# Altium project LimeSDR-USB_1v4.PrjPcb (part 8 of 8)
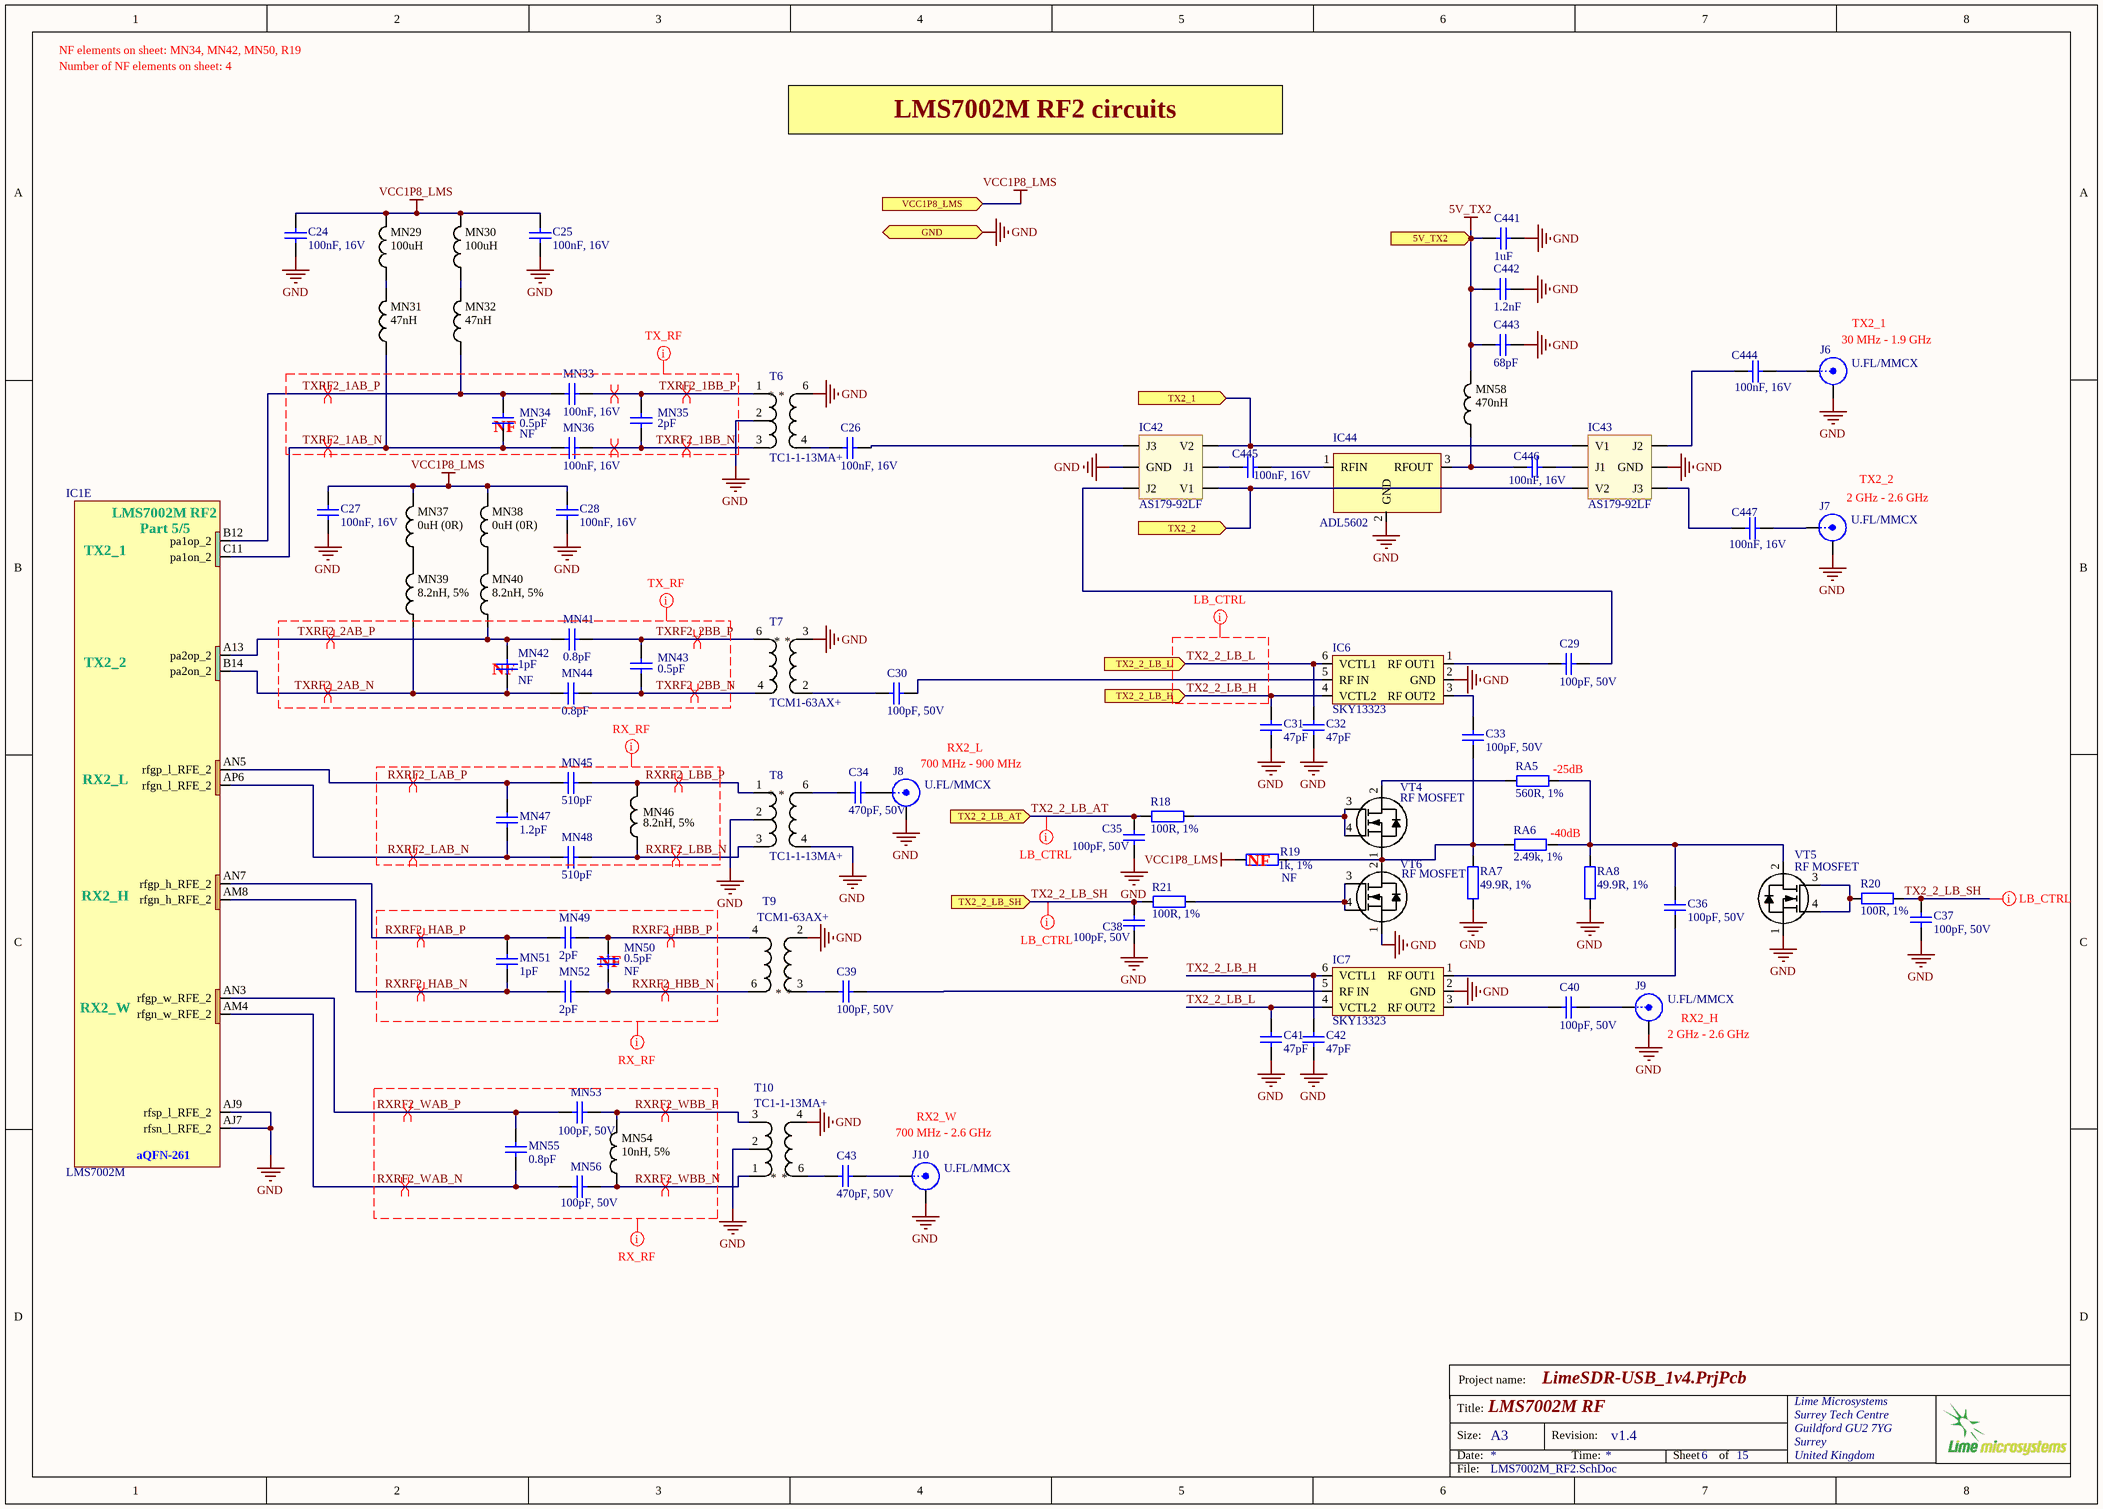
[diagram p114: LMS7002M_RF2.SchDoc]

## Nets that join several sheets
5V_TX1: LMS7002M (C448.2 IC47.9 IC47.10), LMS7002M_RF1 (C434.2 C435.2 C436.2 MN57.2)
5V_TX2: LMS7002M (C450.2 IC48.9 IC48.10), LMS7002M_RF2 (C441.2 C442.2 C443.2 MN58.2)
GND: BoardDiagramEntryConn (C380.1 C381.2 R107.1), 15_BoardPowerSupply (91 pins), 16_BoardPowerSupplyBattery (30 pins), 12_USB3_0_device (79 pins), 13_USB3_0_peripheral (25 pins), FPGA (LED7.3 LEDS1.K2 R50.1), 09_FPGA_banks_5_6_7_8 (22 pins), 08_FPGA_banks_1_2_3_4 (17 pins), LMS7002M (11 pins), LMS7002M_Misc (13 pins), LMS7002M_RF1 (38 pins), LMS7002M_RF2 (38 pins)
VCC3P3_CLK: 15_BoardPowerSupply (R208.1), 14_Clocks (16 pins)
VCC5P0_USB: 16_BoardPowerSupplyBattery (5 pins), 12_USB3_0_device (C272.1 FR38.1 J15.1)
VCC6P0: 15_BoardPowerSupply (8 pins), LMS7002M (9 pins)
VCC_LMS1: 15_BoardPowerSupply (R178.1), LMS7002M_RF1 (9 pins), LMS7002M_RF2 (9 pins)
VCC_P0: 15_BoardPowerSupply (11 pins), 12_USB3_0_device (FR45.2 FR46.2 FR47.2 FR48.1), 10_FPGA_misc (R220.2)
VCC_P2: BoardDiagramEntryConn (R106.2), 15_BoardPowerSupply (R173.1 R211.1), 12_USB3_0_device (FR43.2), 10_FPGA_misc (FR37.1)
VCC_P3: BoardDiagramEntryConn (R105.2 R113.1 R134.1), 15_BoardPowerSupply (28 pins), 12_USB3_0_device (5 pins), 13_USB3_0_peripheral (23 pins), FPGA (R170.1), 10_FPGA_misc (R219.2), 11_DDR2 (C394.2 IC29.10 R177.1 R186.1)
VCC_SYS: 15_BoardPowerSupply (15 pins), 16_BoardPowerSupplyBattery (9 pins), 12_USB3_0_device (FR40.1)
VDIO_LMS: BoardDiagramEntryConn (C380.2 C381.1 FR57.2), LMS7002M_Misc (14 pins)
VDIO_LMS_FPGA: BoardDiagramEntryConn (FR57.1 R105.1 R106.1 R112.1), 14_Clocks (FR50.1), FPGA (R49.2), 10_FPGA_misc (R221.2)
VREF_DDR2: 08_FPGA_banks_1_2_3_4 (24 pins), 11_DDR2 (6 pins)
BQ_INT: 16_BoardPowerSupplyBattery (IC37.7 R217.1), 09_FPGA_banks_5_6_7_8 (IC8.F21)
BQ_nCE: 16_BoardPowerSupplyBattery (IC37.9), 12_USB3_0_device (R63#1.1), 09_FPGA_banks_5_6_7_8 (IC8.H19)
BQ_OTG: 16_BoardPowerSupplyBattery (IC37.8), 09_FPGA_banks_5_6_7_8 (IC8.H20)
DDR2_1_A0: 08_FPGA_banks_1_2_3_4 (IC8.W1), 11_DDR2 (IC11.M8 R77.5)
DDR2_1_A1: 08_FPGA_banks_1_2_3_4 (IC8.AA3), 11_DDR2 (IC11.M3 R75.7)
DDR2_1_A2: 08_FPGA_banks_1_2_3_4 (IC8.Y3), 11_DDR2 (IC11.M7 R77.4)
DDR2_1_A3: 08_FPGA_banks_1_2_3_4 (IC8.V6), 11_DDR2 (IC11.N2 R75.4)
DDR2_1_A4: 08_FPGA_banks_1_2_3_4 (IC8.AA1), 11_DDR2 (IC11.N8 R77.3)
DDR2_1_A5: 08_FPGA_banks_1_2_3_4 (IC8.AB3), 11_DDR2 (IC11.N3 R75.5)
DDR2_1_A6: 08_FPGA_banks_1_2_3_4 (IC8.Y2), 11_DDR2 (IC11.N7 R77.2)
DDR2_1_A7: 08_FPGA_banks_1_2_3_4 (IC8.AB5), 11_DDR2 (IC11.P2 R75.1)
DDR2_1_A8: 08_FPGA_banks_1_2_3_4 (IC8.Y1), 11_DDR2 (IC11.P8 R77.1)
DDR2_1_A9: 08_FPGA_banks_1_2_3_4 (IC8.V7), 11_DDR2 (IC11.P3 R75.3)
DDR2_1_A10: 08_FPGA_banks_1_2_3_4 (IC8.Y6), 11_DDR2 (IC11.M2 R75.6)
DDR2_1_A11: 08_FPGA_banks_1_2_3_4 (IC8.W2), 11_DDR2 (IC11.P7 R75.8)
DDR2_1_A12: 08_FPGA_banks_1_2_3_4 (IC8.T8), 11_DDR2 (IC11.R2 R75.2)
DDR2_1_BA0: 08_FPGA_banks_1_2_3_4 (IC8.V4), 11_DDR2 (IC11.L2 R78.2)
DDR2_1_BA1: 08_FPGA_banks_1_2_3_4 (IC8.V3), 11_DDR2 (IC11.L3 R78.3)
DDR2_1_BA2: 08_FPGA_banks_1_2_3_4 (IC8.V1), 11_DDR2 (IC11.L1 R78.4)
DDR2_1_CLK_N: 08_FPGA_banks_1_2_3_4 (IC8.U8), 11_DDR2 (IC11.K8 R76.2)
DDR2_1_CLK_P: 08_FPGA_banks_1_2_3_4 (IC8.U7), 11_DDR2 (IC11.J8 R76.1)
DDR2_1_CTL0: 08_FPGA_banks_1_2_3_4 (IC8.R7), 11_DDR2 (IC11.K2)
DDR2_1_CTL1: 08_FPGA_banks_1_2_3_4 (IC8.P6), 11_DDR2 (IC11.K9)
DDR2_1_CTL2: 08_FPGA_banks_1_2_3_4 (IC8.T5), 11_DDR2 (IC11.K7)
DDR2_1_CTL3: 08_FPGA_banks_1_2_3_4 (IC8.T4), 11_DDR2 (IC11.L7)
DDR2_1_CTL4: 08_FPGA_banks_1_2_3_4 (IC8.R6), 11_DDR2 (IC11.L8)
DDR2_1_CTL5: 08_FPGA_banks_1_2_3_4 (IC8.T7), 11_DDR2 (IC11.K3)
DDR2_1_DM0: 08_FPGA_banks_1_2_3_4 (IC8.AA7), 11_DDR2 (IC11.F3)
DDR2_1_DM1: 08_FPGA_banks_1_2_3_4 (IC8.V5), 11_DDR2 (IC11.B3)
DDR2_1_DQ0: 08_FPGA_banks_1_2_3_4 (IC8.U10), 11_DDR2 (IC11.G8)
DDR2_1_DQ1: 08_FPGA_banks_1_2_3_4 (IC8.AB8), 11_DDR2 (IC11.G2)
DDR2_1_DQ2: 08_FPGA_banks_1_2_3_4 (IC8.AB7), 11_DDR2 (IC11.H7)
DDR2_1_DQ3: 08_FPGA_banks_1_2_3_4 (IC8.AA9), 11_DDR2 (IC11.H3)
DDR2_1_DQ4: 08_FPGA_banks_1_2_3_4 (IC8.V11), 11_DDR2 (IC11.H1)
DDR2_1_DQ5: 08_FPGA_banks_1_2_3_4 (IC8.W10), 11_DDR2 (IC11.H9)
DDR2_1_DQ6: 08_FPGA_banks_1_2_3_4 (IC8.AA8), 11_DDR2 (IC11.F1)
DDR2_1_DQ7: 08_FPGA_banks_1_2_3_4 (IC8.Y10), 11_DDR2 (IC11.F9)
DDR2_1_DQ8: 08_FPGA_banks_1_2_3_4 (IC8.W6), 11_DDR2 (IC11.C8)
DDR2_1_DQ9: 08_FPGA_banks_1_2_3_4 (IC8.AA5), 11_DDR2 (IC11.C2)
DDR2_1_DQ10: 08_FPGA_banks_1_2_3_4 (IC8.W7), 11_DDR2 (IC11.D7)
DDR2_1_DQ11: 08_FPGA_banks_1_2_3_4 (IC8.V8), 11_DDR2 (IC11.D3)
DDR2_1_DQ12: 08_FPGA_banks_1_2_3_4 (IC8.W8), 11_DDR2 (IC11.D1)
DDR2_1_DQ13: 08_FPGA_banks_1_2_3_4 (IC8.Y7), 11_DDR2 (IC11.D9)
DDR2_1_DQ14: 08_FPGA_banks_1_2_3_4 (IC8.U9), 11_DDR2 (IC11.B1)
DDR2_1_DQ15: 08_FPGA_banks_1_2_3_4 (IC8.AA4), 11_DDR2 (IC11.B9)
DDR2_1_DQS0: 08_FPGA_banks_1_2_3_4 (IC8.AB9), 11_DDR2 (IC11.F7)
DDR2_1_DQS1: 08_FPGA_banks_1_2_3_4 (IC8.V10), 11_DDR2 (IC11.B7)
DDR2_2_A0: 08_FPGA_banks_1_2_3_4 (IC8.U15), 11_DDR2 (IC12.M8 R81.3)
DDR2_2_A1: 08_FPGA_banks_1_2_3_4 (IC8.AA17), 11_DDR2 (IC12.M3 R83.7)
DDR2_2_A2: 08_FPGA_banks_1_2_3_4 (IC8.T14), 11_DDR2 (IC12.M7 R81.1)
DDR2_2_A3: 08_FPGA_banks_1_2_3_4 (IC8.Y17), 11_DDR2 (IC12.N2 R83.2)
DDR2_2_A4: 08_FPGA_banks_1_2_3_4 (IC8.T16), 11_DDR2 (IC12.N8 R81.5)
DDR2_2_A5: 08_FPGA_banks_1_2_3_4 (IC8.P7), 11_DDR2 (IC12.N3 R83.6)
DDR2_2_A6: 08_FPGA_banks_1_2_3_4 (IC8.U17), 11_DDR2 (IC12.N7 R81.2)
DDR2_2_A7: 08_FPGA_banks_1_2_3_4 (IC8.N8), 11_DDR2 (IC12.P2 R83.3)
DDR2_2_A8: 08_FPGA_banks_1_2_3_4 (IC8.R16), 11_DDR2 (IC12.P8 R81.6)
DDR2_2_A9: 08_FPGA_banks_1_2_3_4 (IC8.AA20), 11_DDR2 (IC12.P3 R83.5)
DDR2_2_A10: 08_FPGA_banks_1_2_3_4 (IC8.AB17), 11_DDR2 (IC12.M2 R83.1)
DDR2_2_A11: 08_FPGA_banks_1_2_3_4 (IC8.U16), 11_DDR2 (IC12.P7 R81.4)
DDR2_2_A12: 08_FPGA_banks_1_2_3_4 (IC8.U14), 11_DDR2 (IC12.R2 R83.4)
DDR2_2_BA0: 08_FPGA_banks_1_2_3_4 (IC8.U13), 11_DDR2 (IC12.L2 R84.3)
DDR2_2_BA1: 08_FPGA_banks_1_2_3_4 (IC8.T13), 11_DDR2 (IC12.L3 R84.2)
DDR2_2_BA2: 08_FPGA_banks_1_2_3_4 (IC8.V2), 11_DDR2 (IC12.L1 R84.4)
DDR2_2_CLK_N: 08_FPGA_banks_1_2_3_4 (IC8.R15), 11_DDR2 (IC12.K8 R82.2)
DDR2_2_CLK_P: 08_FPGA_banks_1_2_3_4 (IC8.R14), 11_DDR2 (IC12.J8 R82.1)
DDR2_2_CTL0: 08_FPGA_banks_1_2_3_4 (IC8.AB10), 11_DDR2 (IC12.K2)
DDR2_2_CTL1: 08_FPGA_banks_1_2_3_4 (IC8.T12), 11_DDR2 (IC12.K9)
DDR2_2_CTL2: 08_FPGA_banks_1_2_3_4 (IC8.T11), 11_DDR2 (IC12.K7)
DDR2_2_CTL3: 08_FPGA_banks_1_2_3_4 (IC8.T10), 11_DDR2 (IC12.L7)
DDR2_2_CTL4: 08_FPGA_banks_1_2_3_4 (IC8.Y8), 11_DDR2 (IC12.L8)
DDR2_2_CTL5: 08_FPGA_banks_1_2_3_4 (IC8.T9), 11_DDR2 (IC12.K3)
DDR2_2_DM0: 08_FPGA_banks_1_2_3_4 (IC8.AA16), 11_DDR2 (IC12.F3)
DDR2_2_DM1: 08_FPGA_banks_1_2_3_4 (IC8.AA10), 11_DDR2 (IC12.B3)
DDR2_2_DQ0: 08_FPGA_banks_1_2_3_4 (IC8.W15), 11_DDR2 (IC12.G8)
DDR2_2_DQ1: 08_FPGA_banks_1_2_3_4 (IC8.V14), 11_DDR2 (IC12.G2)
DDR2_2_DQ2: 08_FPGA_banks_1_2_3_4 (IC8.AB20), 11_DDR2 (IC12.H7)
DDR2_2_DQ3: 08_FPGA_banks_1_2_3_4 (IC8.AB18), 11_DDR2 (IC12.H3)
DDR2_2_DQ4: 08_FPGA_banks_1_2_3_4 (IC8.T15), 11_DDR2 (IC12.H1)
DDR2_2_DQ5: 08_FPGA_banks_1_2_3_4 (IC8.W17), 11_DDR2 (IC12.H9)
DDR2_2_DQ6: 08_FPGA_banks_1_2_3_4 (IC8.AB16), 11_DDR2 (IC12.F1)
DDR2_2_DQ7: 08_FPGA_banks_1_2_3_4 (IC8.V15), 11_DDR2 (IC12.F9)
DDR2_2_DQ8: 08_FPGA_banks_1_2_3_4 (IC8.W13), 11_DDR2 (IC12.C8)
DDR2_2_DQ9: 08_FPGA_banks_1_2_3_4 (IC8.AB13), 11_DDR2 (IC12.C2)
DDR2_2_DQ10: 08_FPGA_banks_1_2_3_4 (IC8.AA15), 11_DDR2 (IC12.D7)
DDR2_2_DQ11: 08_FPGA_banks_1_2_3_4 (IC8.AB14), 11_DDR2 (IC12.D3)
DDR2_2_DQ12: 08_FPGA_banks_1_2_3_4 (IC8.AA14), 11_DDR2 (IC12.D1)
DDR2_2_DQ13: 08_FPGA_banks_1_2_3_4 (IC8.AB15), 11_DDR2 (IC12.D9)
DDR2_2_DQ14: 08_FPGA_banks_1_2_3_4 (IC8.AA13), 11_DDR2 (IC12.B1)
DDR2_2_DQ15: 08_FPGA_banks_1_2_3_4 (IC8.U12), 11_DDR2 (IC12.B9)
DDR2_2_DQS0: 08_FPGA_banks_1_2_3_4 (IC8.V13), 11_DDR2 (IC12.F7)
DDR2_2_DQS1: 08_FPGA_banks_1_2_3_4 (IC8.Y13), 11_DDR2 (IC12.B7)
EXP_CONF_DONE: BoardDiagramEntryConn (R176.1), 13_USB3_0_peripheral (IC18.5)
EXP_NCONFIG: BoardDiagramEntryConn (R135.1), 13_USB3_0_peripheral (IC18.9)
EXP_NSTATUS: BoardDiagramEntryConn (R172.1), 13_USB3_0_peripheral (IC18.4)
FAN_CTRL: 08_FPGA_banks_1_2_3_4 (IC8.E4), 10_FPGA_misc (R65.2 R67.1 VT7.G)
FPF_EN: 16_BoardPowerSupplyBattery (IC16.C2 R187#1.2), 09_FPGA_banks_5_6_7_8 (IC8.B21)
FPF_VINSEL: 16_BoardPowerSupplyBattery (IC16.D4), FPGA (R48.1)
FPGA_CONF_DONE: BoardDiagramEntryConn (R112.2 R176.2), 10_FPGA_misc (IC25#1.M18)
FPGA_GPIO0: 08_FPGA_banks_1_2_3_4 (IC8.H8), 10_FPGA_misc (J12.1)
FPGA_GPIO1: 08_FPGA_banks_1_2_3_4 (IC8.H6), 10_FPGA_misc (J12.2)
FPGA_GPIO2: 08_FPGA_banks_1_2_3_4 (IC8.H2), 10_FPGA_misc (J12.3)
FPGA_GPIO3: 08_FPGA_banks_1_2_3_4 (IC8.H1), 10_FPGA_misc (J12.4)
FPGA_GPIO4: 08_FPGA_banks_1_2_3_4 (IC8.G4), 10_FPGA_misc (J12.5)
FPGA_GPIO5: 08_FPGA_banks_1_2_3_4 (IC8.G3), 10_FPGA_misc (J12.6)
FPGA_GPIO6: 08_FPGA_banks_1_2_3_4 (IC8.F2), 10_FPGA_misc (J12.7)
FPGA_GPIO7: 08_FPGA_banks_1_2_3_4 (IC8.F1), 10_FPGA_misc (J12.8)
FPGA_LED1_G: FPGA (R169.1), 08_FPGA_banks_1_2_3_4 (IC8.D2)
FPGA_LED1_R: FPGA (LED2.2 LED2.3 LEDS2.K1), 08_FPGA_banks_1_2_3_4 (IC8.E3)
FPGA_LED2_G: FPGA (R171.1), 08_FPGA_banks_1_2_3_4 (IC8.J4)
FPGA_LED2_R: FPGA (LED8.2 LED8.3 LEDS2.K2), 08_FPGA_banks_1_2_3_4 (IC8.E1)
FPGA_NCONFIG: BoardDiagramEntryConn (R134.2 R135.2), 10_FPGA_misc (IC25#1.K5)
FPGA_NSTATUS: BoardDiagramEntryConn (R113.2 R172.2), 10_FPGA_misc (IC25#1.K6)
FX3_DQ0: 12_USB3_0_device (R87.2), 09_FPGA_banks_5_6_7_8 (IC8.M19)
FX3_DQ1: 12_USB3_0_device (R87.4), 09_FPGA_banks_5_6_7_8 (IC8.AA21)
FX3_DQ2: 12_USB3_0_device (R87.6), 09_FPGA_banks_5_6_7_8 (IC8.Y22)
FX3_DQ3: 12_USB3_0_device (R87.8), 09_FPGA_banks_5_6_7_8 (IC8.Y21)
FX3_DQ4: 12_USB3_0_device (R89.2), 09_FPGA_banks_5_6_7_8 (IC8.W22)
FX3_DQ5: 12_USB3_0_device (R89.4), 09_FPGA_banks_5_6_7_8 (IC8.W21)
FX3_DQ6: 12_USB3_0_device (R89.6), 09_FPGA_banks_5_6_7_8 (IC8.W20)
FX3_DQ7: 12_USB3_0_device (R89.8), 09_FPGA_banks_5_6_7_8 (IC8.V22)
FX3_DQ8: 12_USB3_0_device (R91.2), 09_FPGA_banks_5_6_7_8 (IC8.V21)
FX3_DQ9: 12_USB3_0_device (R91.4), 09_FPGA_banks_5_6_7_8 (IC8.U22)
FX3_DQ10: 12_USB3_0_device (R91.6), 09_FPGA_banks_5_6_7_8 (IC8.U21)
FX3_DQ11: 12_USB3_0_device (R91.8), 09_FPGA_banks_5_6_7_8 (IC8.U20)
FX3_DQ12: 12_USB3_0_device (R96.2), 09_FPGA_banks_5_6_7_8 (IC8.U19)
FX3_DQ13: 12_USB3_0_device (R96.4), 09_FPGA_banks_5_6_7_8 (IC8.M22)
FX3_DQ14: 12_USB3_0_device (R96.6), 09_FPGA_banks_5_6_7_8 (IC8.M21)
FX3_DQ15: 12_USB3_0_device (R96.8), 09_FPGA_banks_5_6_7_8 (IC8.R22)
FX3_DQ16: 12_USB3_0_device (R88.1), 09_FPGA_banks_5_6_7_8 (IC8.R21)
FX3_DQ17: 12_USB3_0_device (R88.3), 09_FPGA_banks_5_6_7_8 (IC8.R20)
FX3_DQ18: 12_USB3_0_device (R88.5), 09_FPGA_banks_5_6_7_8 (IC8.R19)
FX3_DQ19: 12_USB3_0_device (R88.7), 09_FPGA_banks_5_6_7_8 (IC8.R18)
FX3_DQ20: 12_USB3_0_device (R90.1), 09_FPGA_banks_5_6_7_8 (IC8.P22)
FX3_DQ21: 12_USB3_0_device (R90.3), 09_FPGA_banks_5_6_7_8 (IC8.P21)
FX3_DQ22: 12_USB3_0_device (R90.5), 09_FPGA_banks_5_6_7_8 (IC8.M20)
FX3_DQ23: 12_USB3_0_device (R90.7), 09_FPGA_banks_5_6_7_8 (IC8.P16)
FX3_DQ24: 12_USB3_0_device (R94.1), 09_FPGA_banks_5_6_7_8 (IC8.P15)
FX3_DQ25: 12_USB3_0_device (R94.3), 09_FPGA_banks_5_6_7_8 (IC8.N22)
FX3_DQ26: 12_USB3_0_device (R94.5), 09_FPGA_banks_5_6_7_8 (IC8.N21)
FX3_DQ27: 12_USB3_0_device (R94.7), 09_FPGA_banks_5_6_7_8 (IC8.N20)
FX3_DQ28: 12_USB3_0_device (R97.1), 09_FPGA_banks_5_6_7_8 (IC8.N19)
FX3_DQ29: 12_USB3_0_device (R97.3), 09_FPGA_banks_5_6_7_8 (IC8.N18)
FX3_DQ30: 12_USB3_0_device (R97.5), 09_FPGA_banks_5_6_7_8 (IC8.N17)
FX3_DQ31: 12_USB3_0_device (R97.7), 09_FPGA_banks_5_6_7_8 (IC8.N16)
FX3_I2C_SCL: 16_BoardPowerSupplyBattery (IC37.5), 12_USB3_0_device (IC13.D9 R103.2), FPGA (R110.2), 10_FPGA_misc (IC40.8)
FX3_I2C_SDA: 16_BoardPowerSupplyBattery (IC37.6), 12_USB3_0_device (IC13.D10 R104.2), FPGA (R111.2), 10_FPGA_misc (IC40.7)
FX3_LED_G: FPGA (R168.1), 08_FPGA_banks_1_2_3_4 (IC8.G5)
FX3_LED_R: FPGA (LED1.2 LED1.3 LEDS1.K1), 08_FPGA_banks_1_2_3_4 (IC8.H5)
FX3_PCLK: 12_USB3_0_device (R98.1), 10_FPGA_misc (IC8.T21)
FX3_USB_D_N: 16_BoardPowerSupplyBattery (IC38.4), 12_USB3_0_device (IC13.A10)
FX3_USB_D_P: 16_BoardPowerSupplyBattery (IC38.2), 12_USB3_0_device (IC13.A9)
FX3_VBUS: 15_BoardPowerSupply (R185.1), 12_USB3_0_device (C273.2 FR38.2 IC13.E11)
LM75_OS: 13_USB3_0_peripheral (IC17.3 R133.1), 08_FPGA_banks_1_2_3_4 (IC8.J6), 10_FPGA_misc (R65.1)
LMK_CLK: 14_Clocks (IC20.15), 10_FPGA_misc (IC8.B12)
LMS_CORE_LDO_EN: 09_FPGA_banks_5_6_7_8 (IC8.B18), LMS7002M_Misc (IC1.U33 R5.1)
LMS_DIQ1_D0: 09_FPGA_banks_5_6_7_8 (IC8.B17), LMS7002M_Misc (IC1.AG31)
LMS_DIQ1_D1: 09_FPGA_banks_5_6_7_8 (IC8.B16), LMS7002M_Misc (IC1.AF30)
LMS_DIQ1_D2: 09_FPGA_banks_5_6_7_8 (IC8.B15), LMS7002M_Misc (IC1.AF34)
LMS_DIQ1_D3: 09_FPGA_banks_5_6_7_8 (IC8.B14), LMS7002M_Misc (IC1.AE31)
LMS_DIQ1_D4: 09_FPGA_banks_5_6_7_8 (IC8.B13), LMS7002M_Misc (IC1.AD30)
LMS_DIQ1_D5: 09_FPGA_banks_5_6_7_8 (IC8.C13), LMS7002M_Misc (IC1.AC29)
LMS_DIQ1_D6: 09_FPGA_banks_5_6_7_8 (IC8.A18), LMS7002M_Misc (IC1.AE33)
LMS_DIQ1_D7: 09_FPGA_banks_5_6_7_8 (IC8.A17), LMS7002M_Misc (IC1.AD32)
LMS_DIQ1_D8: 09_FPGA_banks_5_6_7_8 (IC8.A16), LMS7002M_Misc (IC1.AC31)
LMS_DIQ1_D9: 09_FPGA_banks_5_6_7_8 (IC8.A15), LMS7002M_Misc (IC1.AC33)
LMS_DIQ1_D10: 09_FPGA_banks_5_6_7_8 (IC8.A14), LMS7002M_Misc (IC1.AB30)
LMS_DIQ1_D11: 09_FPGA_banks_5_6_7_8 (IC8.A13), LMS7002M_Misc (IC1.AB32)
LMS_DIQ2_D0: 09_FPGA_banks_5_6_7_8 (IC8.B7), LMS7002M_Misc (IC1.H30)
LMS_DIQ2_D1: 09_FPGA_banks_5_6_7_8 (IC8.B6), LMS7002M_Misc (IC1.J31)
LMS_DIQ2_D2: 09_FPGA_banks_5_6_7_8 (IC8.B4), LMS7002M_Misc (IC1.K30)
LMS_DIQ2_D3: 09_FPGA_banks_5_6_7_8 (IC8.B3), LMS7002M_Misc (IC1.K32)
LMS_DIQ2_D4: 09_FPGA_banks_5_6_7_8 (IC8.A10), LMS7002M_Misc (IC1.L31)
LMS_DIQ2_D5: 09_FPGA_banks_5_6_7_8 (IC8.A9), LMS7002M_Misc (IC1.K34)
LMS_DIQ2_D6: 09_FPGA_banks_5_6_7_8 (IC8.A8), LMS7002M_Misc (IC1.M30)
LMS_DIQ2_D7: 09_FPGA_banks_5_6_7_8 (IC8.A7), LMS7002M_Misc (IC1.M32)
LMS_DIQ2_D8: 09_FPGA_banks_5_6_7_8 (IC8.A6), LMS7002M_Misc (IC1.N31)
LMS_DIQ2_D9: 09_FPGA_banks_5_6_7_8 (IC8.A5), LMS7002M_Misc (IC1.N33)
LMS_DIQ2_D10: 09_FPGA_banks_5_6_7_8 (IC8.A4), LMS7002M_Misc (IC1.P30)
LMS_DIQ2_D11: 09_FPGA_banks_5_6_7_8 (IC8.A3), LMS7002M_Misc (IC1.P32)
LMS_ENABLE_IQSEL1: 09_FPGA_banks_5_6_7_8 (IC8.C4), LMS7002M_Misc (IC1.Y32)
LMS_ENABLE_IQSEL2: 09_FPGA_banks_5_6_7_8 (IC8.C7), LMS7002M_Misc (IC1.R33)
LMS_FCLK1: 09_FPGA_banks_5_6_7_8 (IC8.B20), LMS7002M_Misc (IC1.AA33)
LMS_FCLK2: 09_FPGA_banks_5_6_7_8 (IC8.E5), LMS7002M_Misc (IC1.R29)
LMS_I2C_SCL: 09_FPGA_banks_5_6_7_8 (IC8.C17), LMS7002M_Misc (IC1.C27 IC2.6 IC3.6 R12.2)
LMS_I2C_SDA: 09_FPGA_banks_5_6_7_8 (IC8.C21), LMS7002M_Misc (IC1.D26 IC2.5 IC3.5 R13.2)
LMS_MCLK1: 10_FPGA_misc (IC8.G21), LMS7002M_Misc (IC1.AB34)
LMS_MCLK2: 10_FPGA_misc (IC8.B11), LMS7002M_Misc (IC1.P34)
LMS_RESET: 09_FPGA_banks_5_6_7_8 (IC8.C6), LMS7002M_Misc (IC1.E27 R2.1)
LMS_RXEN: 09_FPGA_banks_5_6_7_8 (IC8.C3), LMS7002M_Misc (IC1.V34 R4.2)
LMS_TXEN: 09_FPGA_banks_5_6_7_8 (IC8.B10), LMS7002M_Misc (IC1.U29 R3.2)
LMS_TXNRX1: 09_FPGA_banks_5_6_7_8 (IC8.B9), LMS7002M_Misc (IC1.V32 R1.1)
LMS_TXNRX2: 09_FPGA_banks_5_6_7_8 (IC8.B8), LMS7002M_Misc (IC1.U31 R10.2)
NetIC8_B1: 08_FPGA_banks_1_2_3_4 (IC8.B1), 10_FPGA_misc (IC40.6)
NetIC8_B2: 08_FPGA_banks_1_2_3_4 (IC8.B2), 10_FPGA_misc (IC40.11)
NetIC8_B22: FPGA (R48.2 R49.1 R50.2), 09_FPGA_banks_5_6_7_8 (IC8.B22)
NetIC8_C1: 08_FPGA_banks_1_2_3_4 (IC8.C1), 10_FPGA_misc (IC40.5)
NetIC8_C2: 14_Clocks (R146.1), 08_FPGA_banks_1_2_3_4 (IC8.C2)
NetIC8_C8: 09_FPGA_banks_5_6_7_8 (IC8.C8), LMS7002M_Misc (R8.2)
NetIC8_D7: 09_FPGA_banks_5_6_7_8 (IC8.D7), LMS7002M_Misc (R7.2)
NetIC8_D10: 09_FPGA_banks_5_6_7_8 (IC8.D10), LMS7002M_Misc (R9.2)
NetIC8_E6: 09_FPGA_banks_5_6_7_8 (IC8.E6), LMS7002M_Misc (R6.2)
NetIC8_H7: FPGA (R110.1), 08_FPGA_banks_1_2_3_4 (IC8.H7)
NetIC8_J1: BoardDiagramEntryConn (R107.2 R108.2), 08_FPGA_banks_1_2_3_4 (IC8.J1)
NetIC8_J7: FPGA (R111.1), 08_FPGA_banks_1_2_3_4 (IC8.J7)
NetIC8_J8: BoardDiagramEntryConn (R109.2), 08_FPGA_banks_1_2_3_4 (IC8.J8)
NetIC8_K7: 08_FPGA_banks_1_2_3_4 (IC8.K7), 10_FPGA_misc (IC40.1)
NetIC8_R1: 12_USB3_0_device (IC13.F2), 08_FPGA_banks_1_2_3_4 (IC8.R1), 10_FPGA_misc (IC40.9 R167.1)
RxPLL_CLK: 14_Clocks (C325.2 R142.1), LMS7002M_Misc (IC1.AM24)
SI_CLK0: 14_Clocks (IC24.13), 10_FPGA_misc (IC8.T2)
SI_CLK1: 14_Clocks (IC24.12), 10_FPGA_misc (IC8.AA12)
SI_CLK2: 14_Clocks (IC24.9), 10_FPGA_misc (IC8.AB12)
SI_CLK3: 14_Clocks (IC24.8), 10_FPGA_misc (IC8.T22)
SI_CLK5: 14_Clocks (IC24.17), 10_FPGA_misc (IC8.G1)
SI_CLK6: 14_Clocks (IC24.16), 10_FPGA_misc (IC8.AA11)
SI_CLK7: 14_Clocks (IC24.15), 10_FPGA_misc (IC8.AB11)
TX1_2_LB_AT: 09_FPGA_banks_5_6_7_8 (IC8.E15), LMS7002M_RF1 (C15.1 R14.2)
TX1_2_LB_H: 09_FPGA_banks_5_6_7_8 (IC8.H11), LMS7002M_RF1 (C11.2 C22.2 IC4.4 IC5.6)
TX1_2_LB_L: 09_FPGA_banks_5_6_7_8 (IC8.F11), LMS7002M_RF1 (C12.2 C21.2 IC4.6 IC5.4)
TX1_2_LB_SH: 09_FPGA_banks_5_6_7_8 (IC8.F16), LMS7002M_RF1 (C17.1 C18.1 R16.2 R17.1)
TX2_2_LB_AT: 09_FPGA_banks_5_6_7_8 (IC8.E16), LMS7002M_RF2 (C35.1 R18.2)
TX2_2_LB_H: 09_FPGA_banks_5_6_7_8 (IC8.F15), LMS7002M_RF2 (C31.2 C42.2 IC6.4 IC7.6)
TX2_2_LB_L: 09_FPGA_banks_5_6_7_8 (IC8.F14), LMS7002M_RF2 (C32.2 C41.2 IC6.6 IC7.4)
TX2_2_LB_SH: 09_FPGA_banks_5_6_7_8 (IC8.G15), LMS7002M_RF2 (C37.1 C38.1 R20.1 R21.2)
TxPLL_CLK: 14_Clocks (C324.2 R139.1), LMS7002M_Misc (IC1.E5)
USB_D_N: 16_BoardPowerSupplyBattery (IC38.6), 12_USB3_0_device (J15.2)
USB_D_P: 16_BoardPowerSupplyBattery (IC38.10), 12_USB3_0_device (J15.3)
VCC1P8: 15_BoardPowerSupply (R202.1), 14_Clocks (FR52.1), 12_USB3_0_device (FR41.1), 08_FPGA_banks_1_2_3_4 (R46.2), 10_FPGA_misc (R187#2.2)
VCC_P4: 15_BoardPowerSupply (R191.1), 11_DDR2 (C387.2 IC29.1 IC29.2)